# EAGLE design MazeBoard (EAGLE 8.5.0)
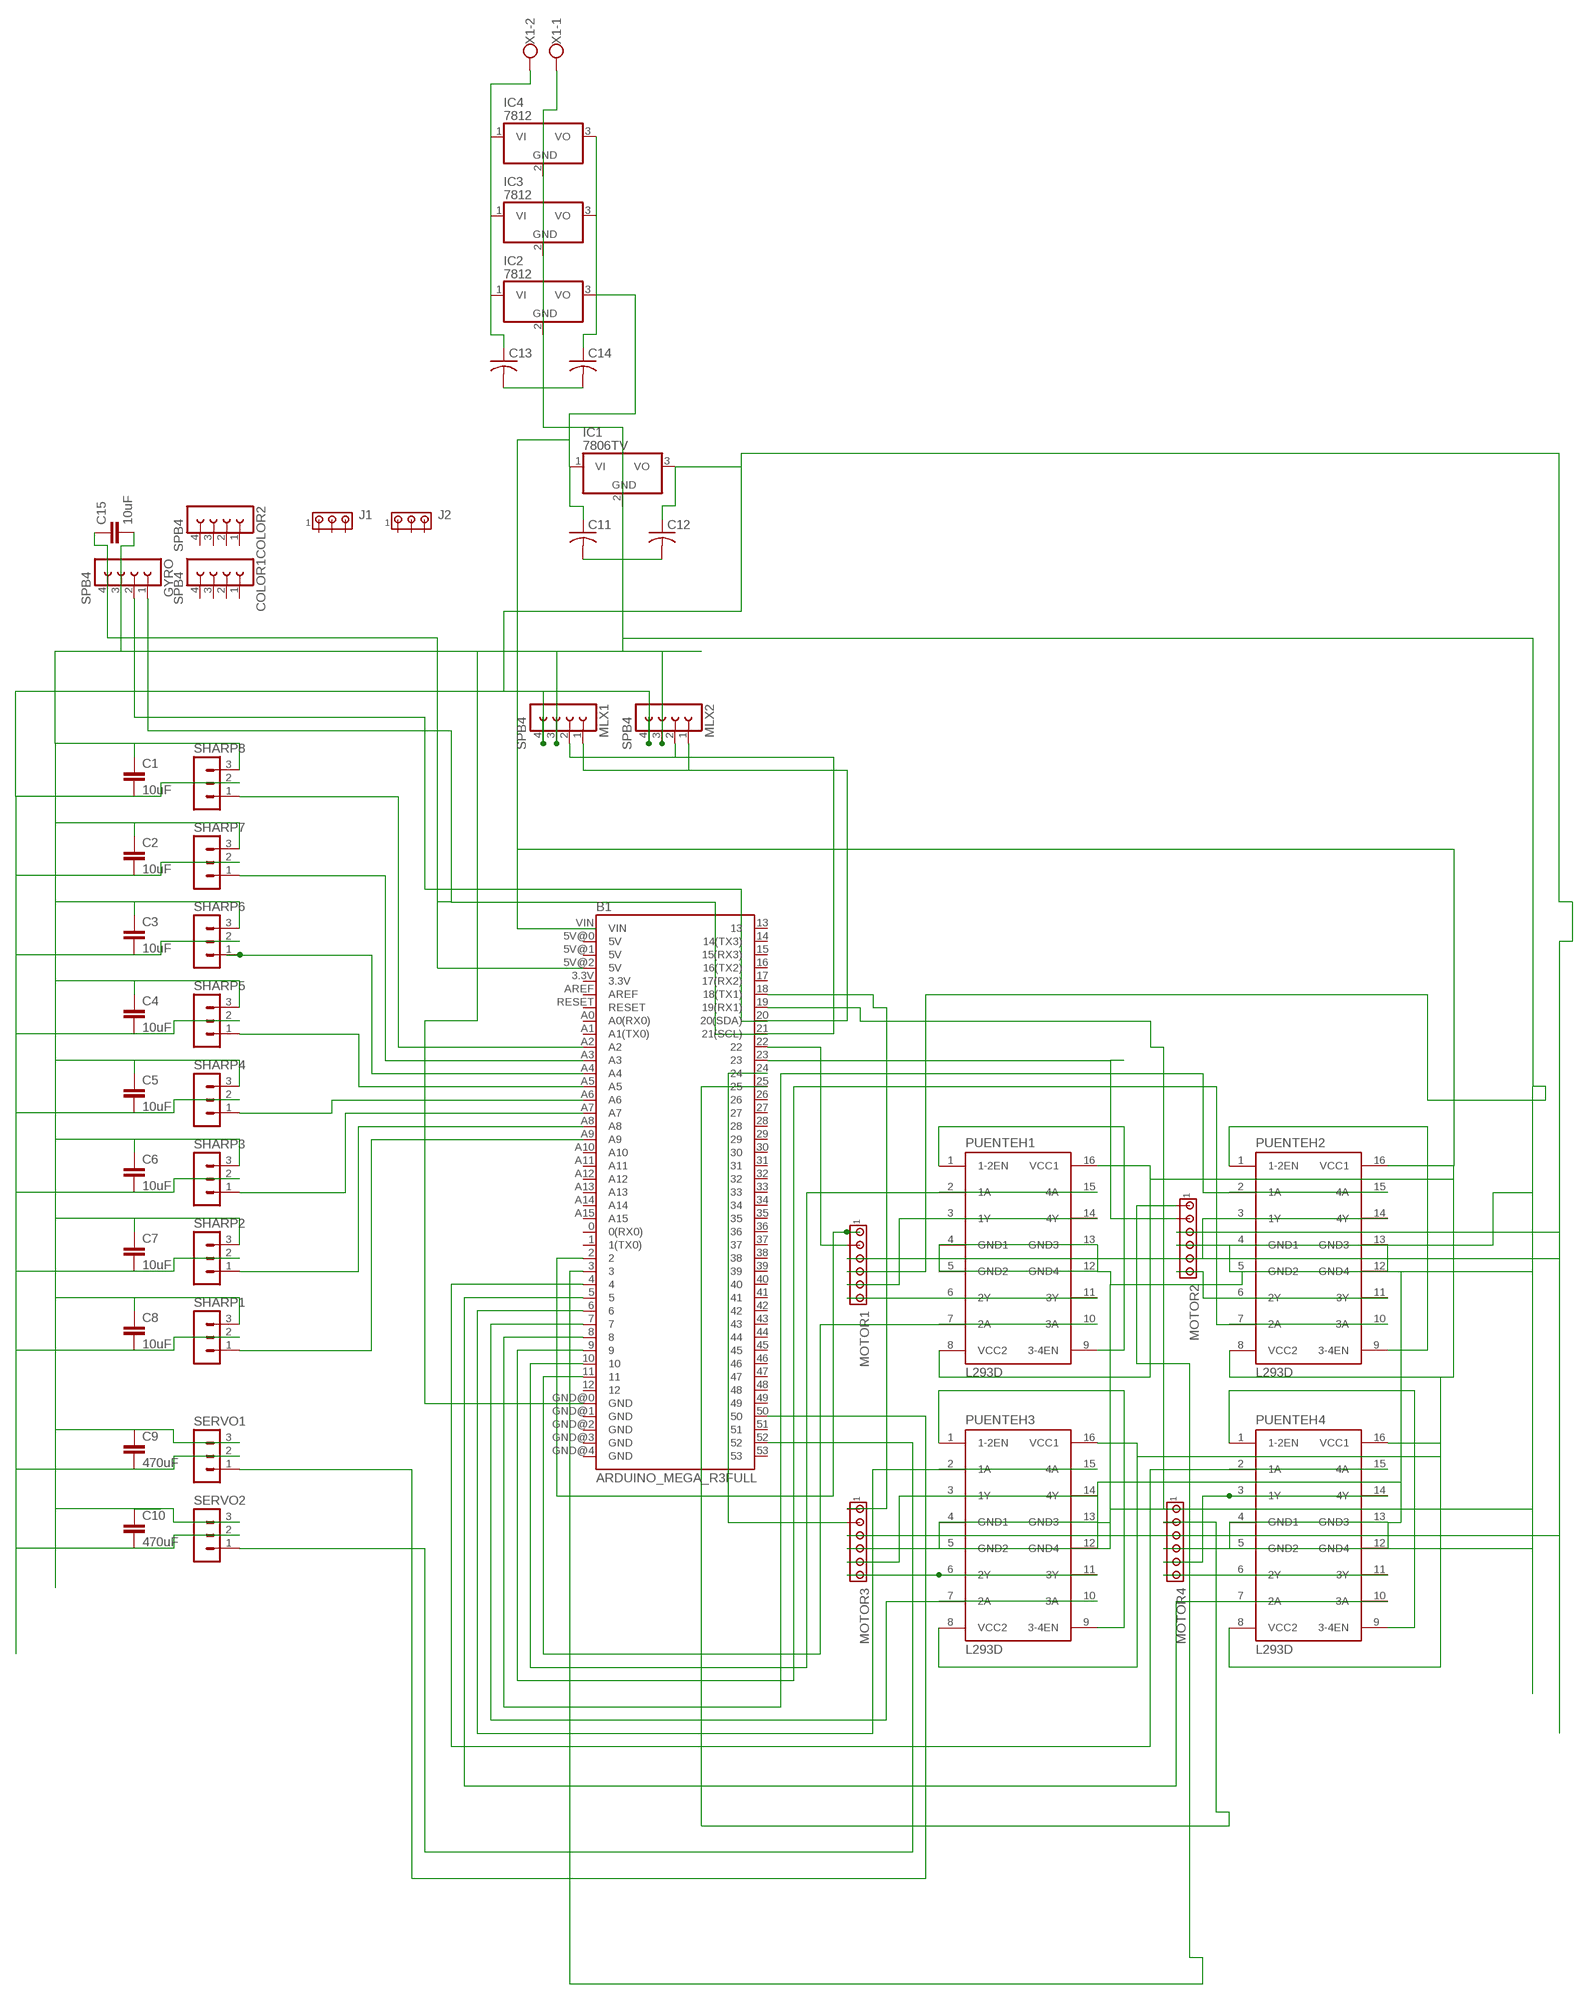
[diagram p0: schematic, sheet 1]

## Parts
B1  ARDUINO_MEGA_R3FULL  [ARDUINO_MEGA]
C1  10uF  C2,5-3  [C2.5-3]
C2  10uF  C2,5-3  [C2.5-3]
C3  10uF  C2,5-3  [C2.5-3]
C4  10uF  C2,5-3  [C2.5-3]
C5  10uF  C2,5-3  [C2.5-3]
C6  10uF  C2,5-3  [C2.5-3]
C7  10uF  C2,5-3  [C2.5-3]
C8  10uF  C2,5-3  [C2.5-3]
C9  470uF  C2,5-3  [C2.5-3]
C10  470uF  C2,5-3  [C2.5-3]
C11  C-US025-024X044  [C025-024X044]
C12  C-US025-024X044  [C025-024X044]
C13  C-US025-024X044  [C025-024X044]
C14  C-US025-024X044  [C025-024X044]
C15  10uF  C2,5-3  [C2.5-3]
COLOR1  SPB4  [SPB4]
COLOR2  SPB4  [SPB4]
GYRO  SPB4  [SPB4]
IC1  7806TV  7805TV  [TO220V]
IC2  7812  7805TV  [TO220V]
IC3  7812  7805TV  [TO220V]
IC4  7812  7805TV  [TO220V]
J1  MTA03-100  [10X03MTA]
J2  MTA03-100  [10X03MTA]
MLX1  SPB4  [SPB4]
MLX2  SPB4  [SPB4]
MOTOR1  MTA06-100  [10X06MTA]
MOTOR2  MTA06-100  [10X06MTA]
MOTOR3  MTA06-100  [10X06MTA]
MOTOR4  MTA06-100  [10X06MTA]
PUENTEH1  L293D  [DIL16]
PUENTEH2  L293D  [DIL16]
PUENTEH3  L293D  [DIL16]
PUENTEH4  L293D  [DIL16]
SERVO1  MA03-1  [MA03-1]
SERVO2  MA03-1  [MA03-1]
SHARP1  MA03-1  [MA03-1]
SHARP2  MA03-1  [MA03-1]
SHARP3  MA03-1  [MA03-1]
SHARP4  MA03-1  [MA03-1]
SHARP5  MA03-1  [MA03-1]
SHARP6  MA03-1  [MA03-1]
SHARP7  MA03-1  [MA03-1]
SHARP8  MA03-1  [MA03-1]
X1  W237-102  [W237-102]

## Nets
6V: C1.2 C2.2 C3.2 C4.2 C5.2 C6.2 C7.2 C8.2 C9.2 C10.2 C12.1 IC1.3(VO) MLX1.4 MLX2.4 MOTOR1.3 MOTOR2.3 MOTOR3.3 MOTOR4.3 SERVO1.2 SERVO2.2 SHARP1.2 SHARP2.2 SHARP3.2 SHARP4.2 SHARP5.2 SHARP6.2 SHARP7.2 SHARP8.2
GND: B1.GND@0(GND) C1.1 C2.1 C3.1 C4.1 C5.1 C6.1 C7.1 C8.1 C9.1 C10.1 C11.2 C12.2 C13.2 C14.2 C15.2 GYRO.3 IC1.2(GND) IC2.2(GND) IC3.2(GND) IC4.2(GND) MLX1.3 MLX2.3 MOTOR1.4 MOTOR2.4 MOTOR3.4 MOTOR4.4 PUENTEH1.4(GND1) PUENTEH1.5(GND2) PUENTEH1.12(GND4) PUENTEH1.13(GND3) PUENTEH2.4(GND1) PUENTEH2.5(GND2) PUENTEH2.12(GND4) PUENTEH2.13(GND3) PUENTEH3.4(GND1) PUENTEH3.5(GND2) PUENTEH3.12(GND4) PUENTEH3.13(GND3) PUENTEH4.4(GND1) PUENTEH4.5(GND2) PUENTEH4.12(GND4) PUENTEH4.13(GND3) SERVO1.3 SERVO2.3 SHARP1.3 SHARP2.3 SHARP3.3 SHARP4.3 SHARP5.3 SHARP6.3 SHARP7.3 SHARP8.3 X1.1
N$1: B1.A4 SHARP6.1
N$2: B1.A5 SHARP5.1
N$3: B1.A6 SHARP4.1
N$4: B1.A7 SHARP3.1
N$5: B1.A2 SHARP8.1
N$6: B1.A3 SHARP7.1
N$7: B1.A8 SHARP2.1
N$8: B1.A9 SHARP1.1
N$9: B1.52 SERVO2.1
N$10: B1.3 MOTOR2.1
N$11: B1.21(21(SCL)) GYRO.1 MLX1.2 MLX2.2
N$12: B1.20(20(SDA)) GYRO.2 MLX1.1 MLX2.1
N$13: B1.5V@2(5V) C15.1 GYRO.4
N$15: PUENTEH1.1(1-2EN) PUENTEH1.9(3-4EN)
N$17: MOTOR3.6 PUENTEH3.6(2Y) PUENTEH3.11(3Y)
N$18: MOTOR3.5 PUENTEH3.3(1Y) PUENTEH3.14(4Y)
N$20: MOTOR4.6 PUENTEH4.6(2Y) PUENTEH4.11(3Y)
N$21: MOTOR4.5 PUENTEH4.3(1Y) PUENTEH4.14(4Y)
N$22: MOTOR1.6 PUENTEH1.6(2Y) PUENTEH1.11(3Y)
N$23: MOTOR1.5 PUENTEH1.3(1Y) PUENTEH1.14(4Y)
N$24: MOTOR2.5 PUENTEH2.3(1Y) PUENTEH2.14(4Y)
N$25: MOTOR2.6 PUENTEH2.6(2Y) PUENTEH2.11(3Y)
N$26: PUENTEH3.1(1-2EN) PUENTEH3.9(3-4EN)
N$27: PUENTEH4.1(1-2EN) PUENTEH4.9(3-4EN)
N$30: B1.7 PUENTEH3.7(2A) PUENTEH3.10(3A)
N$31: B1.6 PUENTEH3.2(1A) PUENTEH3.15(4A)
N$32: B1.4 PUENTEH4.2(1A) PUENTEH4.15(4A)
N$33: B1.5 PUENTEH4.7(2A) PUENTEH4.10(3A)
N$35: B1.11 PUENTEH1.7(2A) PUENTEH1.10(3A)
N$36: B1.10 PUENTEH1.2(1A) PUENTEH1.15(4A)
N$37: B1.2 MOTOR1.1
N$38: B1.9 PUENTEH2.7(2A) PUENTEH2.10(3A)
N$39: PUENTEH2.1(1-2EN) PUENTEH2.9(3-4EN)
N$41: B1.18(18(TX1)) MOTOR3.1
N$42: B1.19(19(RX1)) MOTOR4.1
N$43: B1.50 SERVO1.1
N$44: B1.22 MOTOR1.2
N$45: B1.8 PUENTEH2.2(1A) PUENTEH2.15(4A)
N$46: B1.24 MOTOR3.2
N$47: B1.25 MOTOR4.2
N$48: B1.23 MOTOR2.2
N$52: C11.1 C14.1 IC1.1(VI) IC2.3(VO) IC3.3(VO) IC4.3(VO) PUENTEH1.8(VCC2) PUENTEH1.16(VCC1) PUENTEH2.8(VCC2) PUENTEH2.16(VCC1) PUENTEH3.8(VCC2) PUENTEH3.16(VCC1) PUENTEH4.8(VCC2) PUENTEH4.16(VCC1)
N$54: C13.1 IC2.1(VI) IC3.1(VI) IC4.1(VI) X1.2
Unconnected: B1.0(0(RX0)) B1.1(1(TX0)) B1.3.3V B1.5V@0(5V) B1.5V@1(5V) B1.12 B1.13 B1.14(14(TX3)) B1.15(15(RX3)) B1.16(16(TX2)) B1.17(17(RX2)) B1.26 B1.27 B1.28 B1.29 B1.30 B1.31 B1.32 B1.33 B1.34 B1.35 B1.36 B1.37 B1.38 B1.39 B1.40 B1.41 B1.42 B1.43 B1.44 B1.45 B1.46 B1.47 B1.48 B1.49 B1.51 B1.53 B1.A0(A0(RX0)) B1.A1(A1(TX0)) B1.A10 B1.A11 B1.A12 B1.A13 B1.A14 B1.A15 B1.AREF B1.GND@1(GND) B1.GND@2(GND) B1.GND@3(GND) B1.GND@4(GND) B1.RESET B1.VIN COLOR1.1 COLOR1.2 COLOR1.3 COLOR1.4 COLOR2.1 COLOR2.2 COLOR2.3 COLOR2.4 J1.1 J1.2 J1.3 J2.1 J2.2 J2.3

## Library data of the parts
B1 = SparkFun-Boards:ARDUINO_MEGA_R3: Arduino Mega R3 ATmega2560 R3 compatible footprint. SparkFun Products: Arduino Mega 2560 R3 <https://www.sparkfun.com/products/11061>
C1-C10 C15 = capacitor-wima:C: CAPACITOR naming: grid - package width
C11-C14 = rcl:C-US: CAPACITOR, American symbol
COLOR1 COLOR2 GYRO MLX1 MLX2 = con-hirschmann:SPB4: CONNECTOR 4 pins; OC_FARNELL: unknown; OC_NEWARK: unknown
IC1-IC4 = linear:78*: Positive VOLTAGE REGULATOR Source: http://cache.national.com/ds/LM/LM78L05.pdf http://www.fairchildsemi.com/ds/LM/LM7805.pdf
J1 J2 = con-amp:MTA03-100: AMP connector
MOTOR1-MOTOR4 = con-amp:MTA06-100: AMP connector Connection corrected 2014-09-19
PUENTEH1-PUENTEH4 = st-microelectronics:L293D: PUSH-PULL 4 CHANNEL DRIVER; MPN: L293D; OC_FARNELL: 9589619; OC_NEWARK: 56P8249
SERVO1 SERVO2 SHARP1-SHARP8 = con-lstb:MA03-1: PIN HEADER; OC_FARNELL: unknown; OC_NEWARK: unknown
X1 = con-wago-500:W237-102: WAGO SCREW CLAMP; MPN: 237-102; OC_FARNELL: unknown; OC_NEWARK: 70K9898

## Board
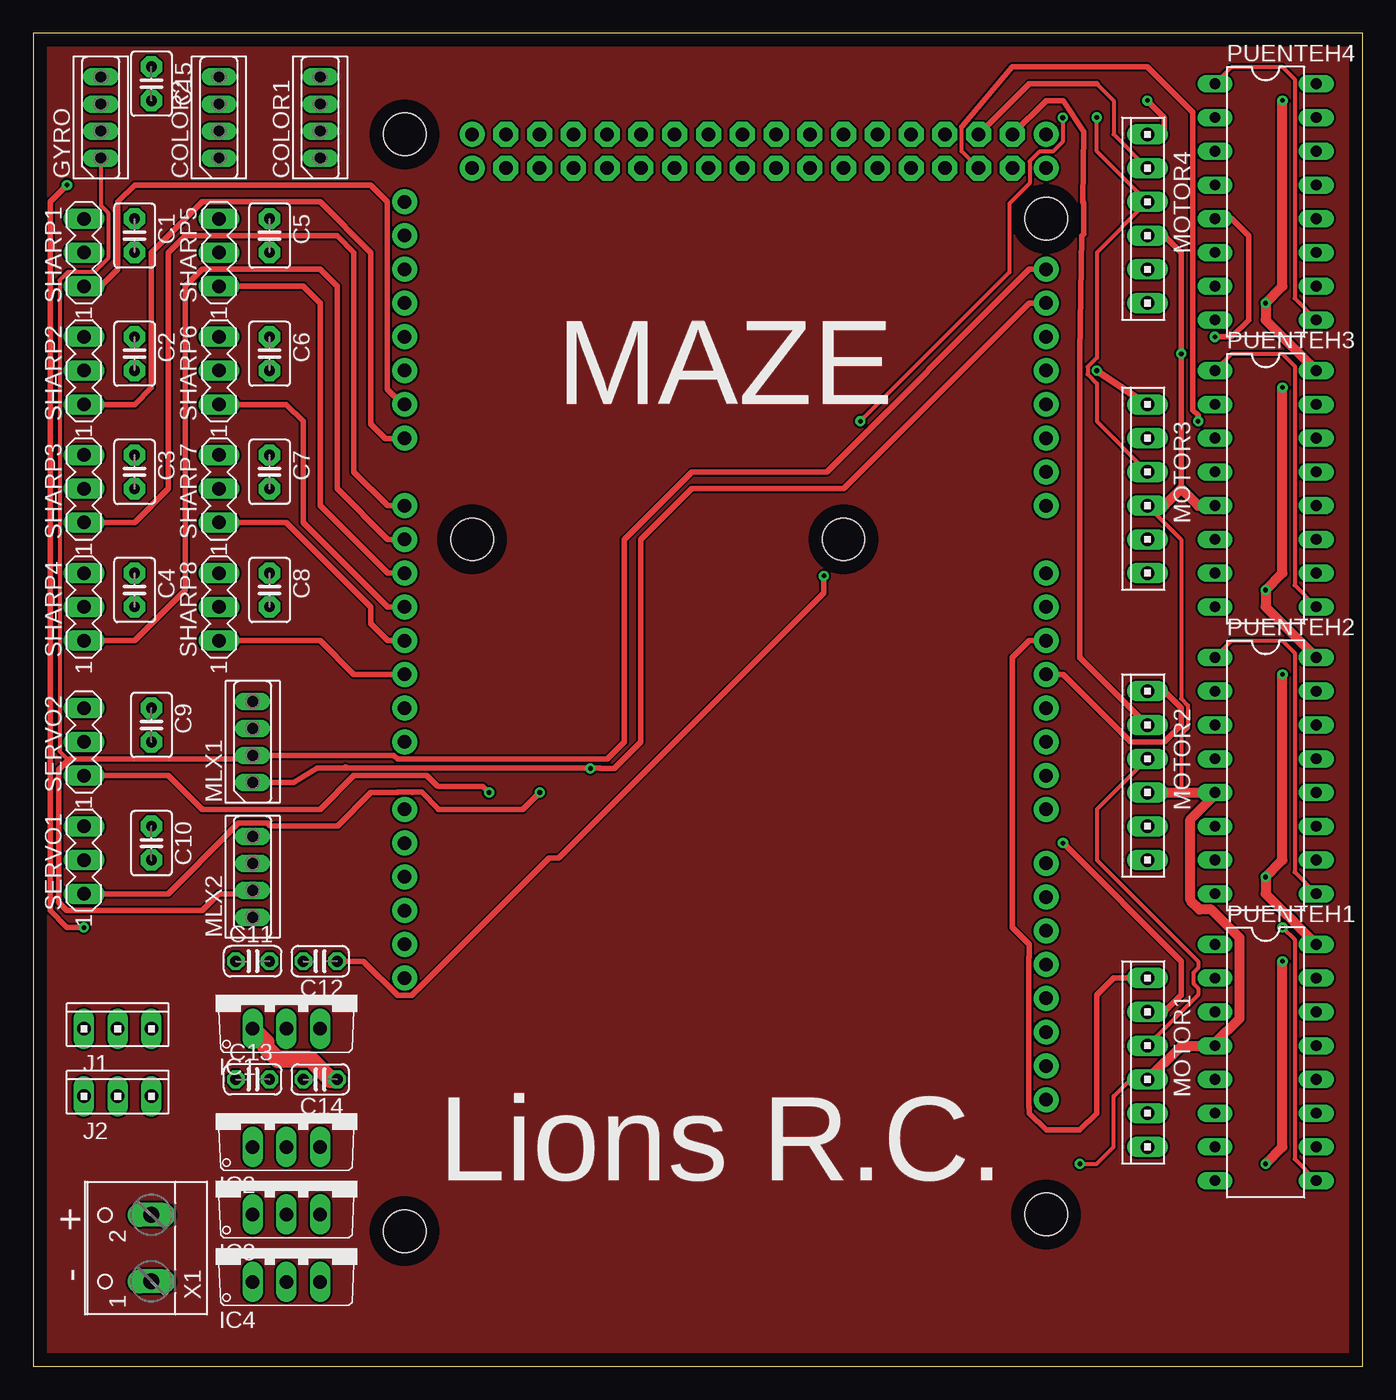
[diagram p1: board, top side]
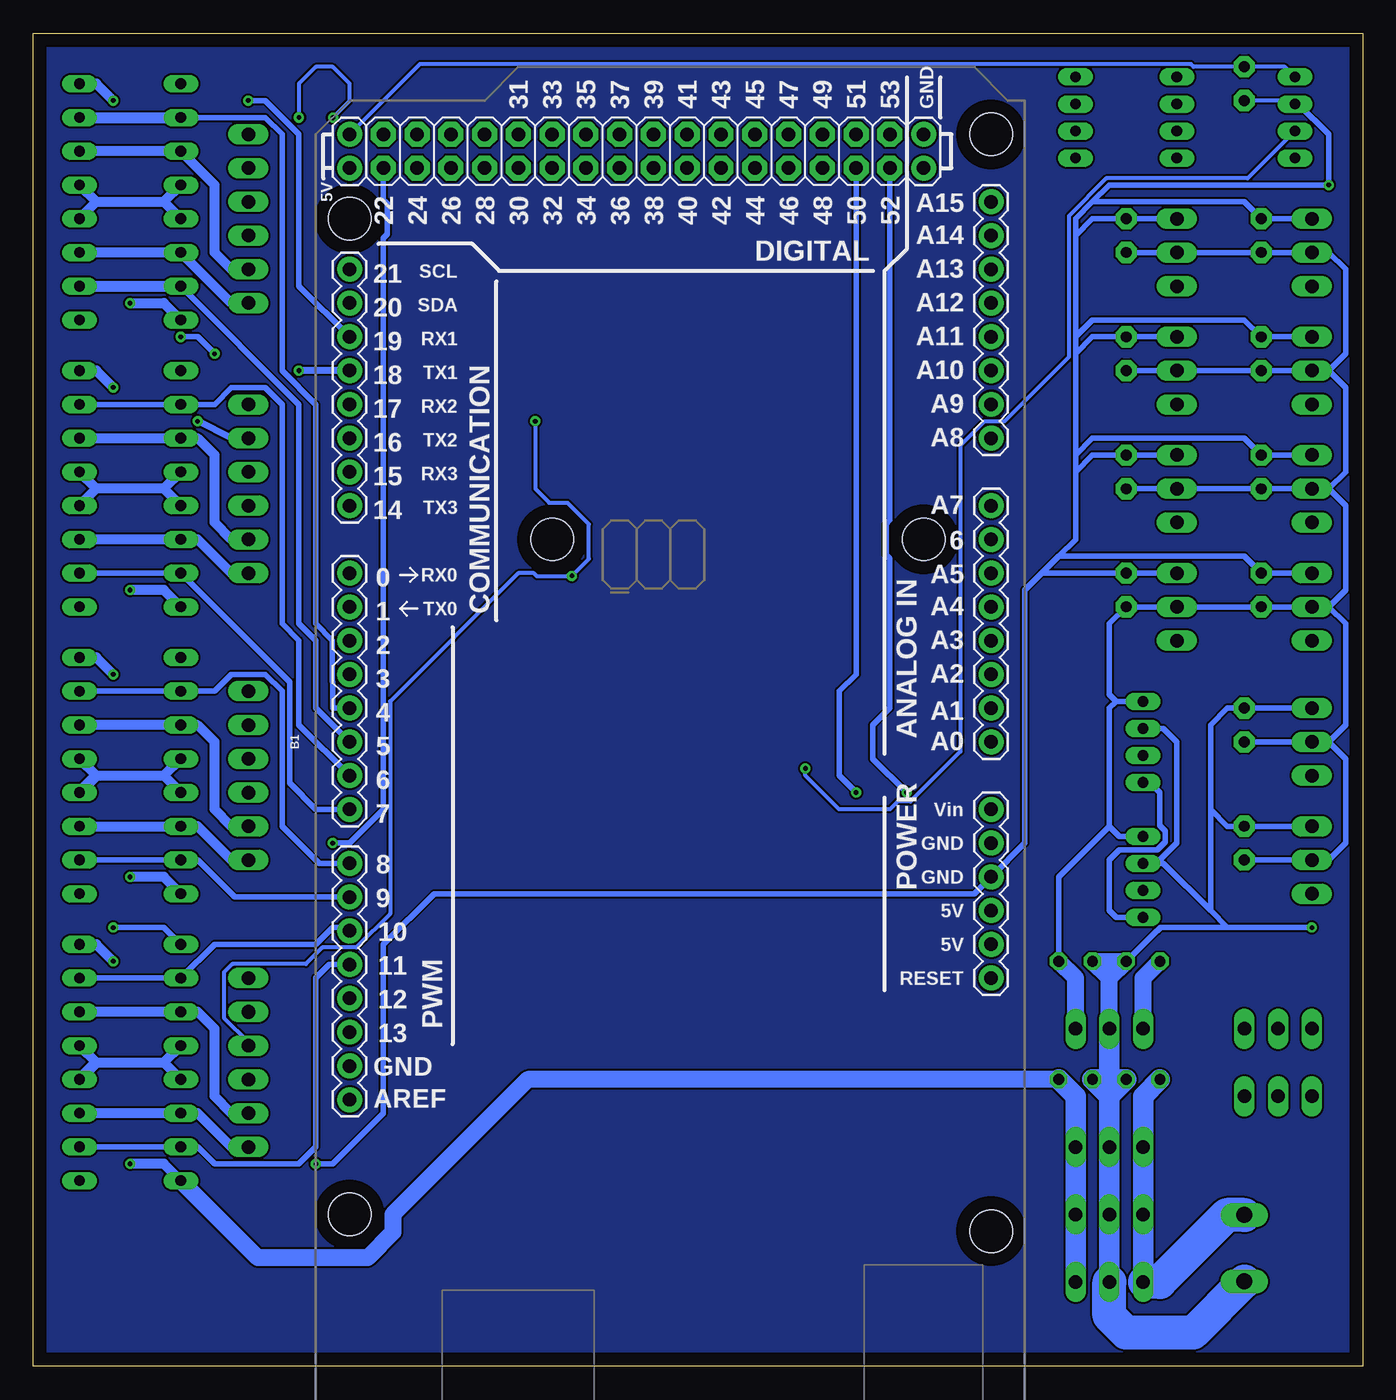
[diagram p2: board, bottom side, seen from below]

Size 100 x 100.32 mm. Coordinates in mm from the lower left corner, seen from the top.
Outline: 0,0 100,0 100,100.32 0,100.32 0,0
Copper layers (1*16): Top 0.035mm / dielectric 1.5mm / Bottom 0.035mm
Design rules "default": minimum track width 6mil, minimum drill 0.35mm, track to track 6mil, track to pad 6mil, pad to pad 6mil, via to via 6mil, smd to smd 6mil, copper to edge 40mil, drill to drill 6mil, minimum pad ring 10mil, minimum via ring 8mil, stop-mask expansion 4mil, vias tented up to drill 0mil, thermal gap 10mil

### Footprints (pad centres in the part's own frame; a part is rotated, then mirrored left to right if it is on the bottom)
ARDUINO_MEGA = drill 1.016 pad 1.88: 0 13.97,24.13; 1 11.43,24.13; 2 8.89,24.13; 3 6.35,24.13; 3.3V -13.97,-24.13; 4 3.81,24.13; 5 1.27,24.13; 5V@0 -11.43,-24.13; 5V@1 44.45,24.13; 5V@2 46.99,24.13; 6 -1.27,24.13; 7 -3.81,24.13; 8 -7.874,24.13; 9 -10.414,24.13; 10 -12.954,24.13; 11 -15.494,24.13; 12 -18.034,24.13; 13 -20.574,24.13; 14 19.05,24.13; 15 21.59,24.13; 16 24.13,24.13; 17 26.67,24.13; 18 29.21,24.13; 19 31.75,24.13; 20 34.29,24.13; 21 36.83,24.13; A0 1.27,-24.13; A1 3.81,-24.13; A2 6.35,-24.13; A3 8.89,-24.13; A4 11.43,-24.13; A5 13.97,-24.13; A6 16.51,-24.13; A7 19.05,-24.13; A8 24.13,-24.13; A9 26.67,-24.13; A10 29.21,-24.13; A11 31.75,-24.13; A12 34.29,-24.13; A13 36.83,-24.13; A14 39.37,-24.13; A15 41.91,-24.13; AREF -25.654,24.13; GND@0 -8.89,-24.13; GND@1 -6.35,-24.13; GND@2 44.45,-19.05; GND@3 46.99,-19.05; GND@4 -23.114,24.13; RESET -16.51,-24.13; VIN -3.81,-24.13 | drill 1.016 pad 1.88 octagon: 22 44.45,21.59; 23 46.99,21.59; 24 44.45,19.05; 25 46.99,19.05; 26 44.45,16.51; 27 46.99,16.51; 28 44.45,13.97; 29 46.99,13.97; 30 44.45,11.43; 31 46.99,11.43; 32 44.45,8.89; 33 46.99,8.89; 34 44.45,6.35; 35 46.99,6.35; 36 44.45,3.81; 37 46.99,3.81; 38 44.45,1.27; 39 46.99,1.27; 40 44.45,-1.27; 41 46.99,-1.27; 42 44.45,-3.81; 43 46.99,-3.81; 44 44.45,-6.35; 45 46.99,-6.35; 46 44.45,-8.89; 47 46.99,-8.89; 48 44.45,-11.43; 49 46.99,-11.43; 50 44.45,-13.97; 51 46.99,-13.97; 52 44.45,-16.51; 53 46.99,-16.51 | hole 3.2: -34.29,24.13; -35.56,-24.13; 16.51,8.89; 16.51,-19.05; 40.64,24.13; 46.99,-24.13
C2.5-3 = drill 0.813 pad 1.6 octagon: 1 -1.27,0; 2 1.27,0
C025-024X044 = drill 0.813 octagon: 1 -1.27,0; 2 1.27,0
SPB4 = drill 0.813 long: 1 -3.048,0; 2 -1.016,0; 3 1.016,0; 4 3.048,0
TO220V = drill 1.016 long: 1 -2.54,-2.54; 2 0,-2.54; 3 2.54,-2.54
10X03MTA = drill 1.016 long: 1 2.54,0; 2 0,0; 3 -2.54,0
10X06MTA = drill 1.016 long: 1 6.35,0; 2 3.81,0; 3 1.27,0; 4 -1.27,0; 5 -3.81,0; 6 -6.35,0
DIL16 = drill 0.813 long: 1 -8.89,-3.81; 2 -6.35,-3.81; 3 -3.81,-3.81; 4 -1.27,-3.81; 5 1.27,-3.81; 6 3.81,-3.81; 7 6.35,-3.81; 8 8.89,-3.81; 9 8.89,3.81; 10 6.35,3.81; 11 3.81,3.81; 12 1.27,3.81; 13 -1.27,3.81; 14 -3.81,3.81; 15 -6.35,3.81; 16 -8.89,3.81
MA03-1 = drill 1.016 long: 1 -2.54,0; 2 0,0; 3 2.54,0
W237-102 = drill 1.194 long: 1 -2.5,-1.27; 2 2.5,-1.27

### Placement (x,y rotation side)
B1  52.07,45.72 90 bottom
C1  7.62,85.09 270 top
C2  7.62,76.2 270 top
C3  7.62,67.31 270 top
C4  7.62,58.42 270 top
C5  17.78,85.09 270 top
C6  17.78,76.2 270 top
C7  17.78,67.31 270 top
C8  17.78,58.42 270 top
C9  8.89,48.26 270 top
C10  8.89,39.37 270 top
C11  16.51,30.48 0 top
C12  21.59,30.48 180 top
C13  16.51,21.59 0 top
C14  21.59,21.59 180 top
C15  8.89,96.52 270 top
COLOR1  21.59,93.98 90 top
COLOR2  13.97,93.98 90 top
GYRO  5.08,93.98 90 top
IC1  19.05,27.94 0 top
IC2  19.05,19.05 0 top
IC3  19.05,13.97 0 top
IC4  19.05,8.89 0 top
J1  6.35,25.4 0 top
J2  6.35,20.32 0 top
MLX1  16.51,46.99 90 top
MLX2  16.51,36.83 90 top
MOTOR1  83.82,22.86 90 top
MOTOR2  83.82,44.45 90 top
MOTOR3  83.82,66.04 90 top
MOTOR4  83.82,86.36 90 top
PUENTEH1  92.71,22.86 270 top
PUENTEH2  92.71,44.45 270 top
PUENTEH3  92.71,66.04 270 top
PUENTEH4  92.71,87.63 270 top
SERVO1  3.81,38.1 90 top
SERVO2  3.81,46.99 90 top
SHARP1  3.81,83.82 90 top
SHARP2  3.81,74.93 90 top
SHARP3  3.81,66.04 90 top
SHARP4  3.81,57.15 90 top
SHARP5  13.97,83.82 90 top
SHARP6  13.97,74.93 90 top
SHARP7  13.97,66.04 90 top
SHARP8  13.97,57.15 90 top
X1  7.62,8.89 90 top

### Tracks (layer width: path | path; a pad name or v marks a point on that pad's centre or on a via)
6V  (via drill 0.35)
  Top 0.305: MOTOR3.3 80.01,71.12 80.01,73.96 79.33,74.65 79.33,75.21 80.01,75.9 80.01,83.82 MOTOR4.3 80.01,91.44 v80.01,93.98 | MOTOR2.3 80.01,41.91 80.01,38.1 87.63,30.48 87.63,29.96 87.27,29.61 87.27,28.81 87.63,28.45 87.63,27.94 MOTOR1.3 | v62.23,71.12 73.43,82.32 73.43,87.51 74.95,89.03 74.95,90.69 75.68,91.41 76.72,91.41 77.45,92.14 v77.45,93.96
  Top 0.406: C12.1 24.84,30.48 27.4,27.91 28.48,27.91 38.83,38.27 39.54,38.27 59.48,58.21 v59.48,59.48 59.6,59.6
  Bottom 0.305: v62.23,71.12 62.23,66.04 61.19,65 59.81,65 58.19,63.38 58.19,60.76 v59.48,59.48 | 59.8,59.48 59.64,59.64 v59.48,59.48 | MOTOR1.3 83.82,24.4 85.65,26.23 85.65,29.65 85.02,30.28 79.5,30.28 78.25,31.52 75.68,31.52 73.15,34.05 73.15,50.04 63.5,59.69 62.34,59.69 62.11,59.46 59.81,59.46 59.8,59.48 | v77.45,93.96 77.45,94 76.2,95.25 76.2,96.52 77.47,97.79 78.74,97.79 80.01,96.52 v80.01,93.98 | 59.8,59.48 v59.48,59.48
  Bottom 0.406: C10.2 SERVO1.2 2.54,38.1 1.27,39.37 1.27,45.72 2.54,46.99 | C9.2 SERVO2.2 2.54,46.99 | C5.2 SHARP5.2 C1.2 SHARP1.2 2.54,83.82 1.27,82.55 1.27,76.2 2.54,74.93 | C6.2 SHARP6.2 C2.2 SHARP2.2 2.54,74.93 | C7.2 SHARP7.2 C3.2 SHARP3.2 2.54,66.04 | 2.54,66.04 1.27,64.77 1.27,58.42 2.54,57.15 | 2.54,74.93 1.27,73.66 1.27,67.31 2.54,66.04 | 2.54,57.15 SHARP4.2 C4.2 SHARP8.2 C8.2 19.05,55.88 19.05,50.55 18.54,50.04 | 2.54,57.15 1.27,55.88 1.27,48.26 2.54,46.99 | MLX2.4 18.29,39.88 19.05,40.64 | 18.54,50.04 MLX1.4 | 18.54,50.04 19.05,49.53 19.05,40.64 | 19.05,40.64 22.86,36.83 C12.1 | 59.6,59.6 v59.48,59.48
  Bottom 1.27: IC1.3 21.59,29.21 C12.1
GND  (via drill 0.35)
  Top 0.305: MOTOR3.4 86.36,62.23 86.36,50.25 86.87,49.74 86.87,48.05 86.36,47.54 86.36,43.18 | v78.74,15.24 80.01,15.24 81.28,16.51 81.28,20.32 82.55,21.59
  Top 0.406: 82.55,21.59 MOTOR1.4 84.84,22.1 | 86.36,43.18 MOTOR2.4 | MOTOR4.4 85.09,85.09 86.36,83.82 v86.36,76.2 86.36,66.04 | v2.54,88.9 1.27,87.63 1.27,34.29 2.54,33.02 v3.81,33.02 | PUENTEH4.5 90.17,86.36 91.44,85.09 91.44,78.74 90.17,77.47 v88.9,77.47
  Top 0.762: PUENTEH3.5 87.63,64.77 86.36,66.04 85.09,64.77 MOTOR3.4 | 86.36,43.18 PUENTEH2.5 | PUENTEH2.5 88.9,42.99 87.05,41.13 87.05,35.07 87.75,34.37 88.63,34.37 90.75,32.24 90.75,26.18 88.9,24.32 PUENTEH1.4 86.41,24.13 85.12,22.84 85.06,22.84 MOTOR1.4 | MOTOR2.4 PUENTEH2.5
  Bottom 0.305: GYRO.3 5.33,95.25 C15.2
  Bottom 0.406: SERVO1.3 C10.1 10.16,40.64 11.43,41.91 | SERVO2.3 C9.1 10.16,49.53 11.43,48.26 11.43,41.91 | SHARP4.3 C4.1 8.89,60.96 22.86,60.96 | SHARP3.3 C3.1 8.89,69.85 20.32,69.85 21.59,68.58 | SHARP1.3 C1.1 8.89,87.63 20.32,87.63 | SHARP2.3 C2.1 8.89,78.74 20.32,78.74 21.59,77.47 | SHARP5.3 C5.1 20.32,86.36 21.59,85.09 | SHARP6.3 C6.1 20.32,77.47 21.59,76.2 | SHARP7.3 C7.1 20.32,68.58 21.59,67.31 | SHARP8.3 C8.1 24.13,59.69 | 21.59,67.31 21.59,62.23 22.86,60.96 | 22.86,60.96 24.13,59.69 | 21.59,68.58 21.59,76.2 | 21.59,68.58 21.59,67.31 | 21.59,77.47 21.59,85.09 | 21.59,77.47 21.59,76.2 | 20.32,87.63 21.59,86.36 21.59,85.09 | 11.43,34.29 11.43,41.91 | 11.43,34.29 10.16,33.02 | 10.16,33.02 v3.81,33.02 | 20.32,87.63 19.05,88.9 v2.54,88.9 2.54,92.71 4.83,95 GYRO.3 | 24.13,59.69 25.4,58.42 25.4,39.37 B1.GND@0 29.21,35.56 69.85,35.56 73.66,31.75 73.66,19.05 77.47,15.24 v78.74,15.24 | MLX1.3 14.99,48.01 13.97,46.99 13.97,39.37 15.24,38.1 16.26,38.1 MLX2.3 14.99,37.85 11.43,34.29 | 10.16,33.02 15.18,33.02 15.43,32.77 15.49,32.77 C11.2 | v88.9,77.47 87.63,77.47 v86.36,76.2
  Bottom 0.762: 90.17,44.45 PUENTEH2.5 | 90.17,44.45 95.25,44.45 PUENTEH2.13 | PUENTEH2.4 90.17,44.45 | 90.17,87.63 PUENTEH4.5 | 95.25,87.63 90.17,87.63 | 95.25,87.63 PUENTEH4.12 | PUENTEH4.13 95.25,87.63 | PUENTEH4.4 90.17,87.63 | PUENTEH3.5 90.17,66.04 | 90.17,66.04 95.25,66.04 | PUENTEH3.12 95.25,66.04 | 95.25,66.04 PUENTEH3.13 | PUENTEH3.4 90.17,66.04 | 90.17,22.86 PUENTEH1.5 | 90.17,22.86 95.25,22.86 PUENTEH1.13 | PUENTEH1.4 90.17,22.86
  Bottom 0.813: PUENTEH2.12 95.25,44.45 | PUENTEH1.12 95.25,22.86
  Bottom 1.27: IC3.2 IC2.2 | IC1.2 19.05,29.21 | 19.05,29.21 C11.2 C12.2 19.05,29.21
  Bottom 1.524: IC4.2 IC2.2 19.05,20.32 | 19.05,20.32 C14.2 | 19.05,20.32 C13.2 C14.2 | IC1.2 19.05,21.59 C14.2
  Bottom 2.54: X1.1 12.74,2.54 17.78,2.54 19.05,3.81 IC4.2
N$1
  Top 0.406: SHARP6.1 19.05,72.39 20.32,71.12 20.32,63.5 26.67,57.15 B1.A4
N$2
  Top 0.406: SHARP5.1 20.32,81.28 21.59,80.01 21.59,64.77 26.67,59.69 B1.A5
N$3
  Top 0.406: SHARP4.1 7.62,54.61 11.43,58.42 11.43,81.28 12.7,82.55 21.59,82.55 22.86,81.28 22.86,66.04 26.67,62.23 B1.A6
N$4
  Top 0.406: SHARP3.1 7.62,63.5 10.16,66.04 10.16,83.82 11.43,85.09 22.86,85.09 24.13,83.82 24.13,67.31 26.67,64.77 B1.A7
N$5
  Top 0.406: SHARP8.1 21.59,54.61 24.13,52.07 B1.A2
N$6
  Top 0.406: B1.A3 26.67,54.61 25.4,55.88 25.4,57.15 19.05,63.5 SHARP7.1
N$7
  Top 0.406: SHARP2.1 7.62,72.39 8.89,73.66 8.89,83.82 12.7,87.63 21.59,87.63 25.4,83.82 25.4,70.9 26.48,69.82 27.91,69.82 B1.A8
N$8
  Top 0.406: SHARP1.1 5.08,81.28 6.35,82.55 6.35,87.63 7.62,88.9 25.4,88.9 26.64,87.66 26.64,73.54 27.17,73.01 B1.A9
N$9  (via drill 0.35)
  Top 0.406: SERVO2.1 10.16,44.45 12.7,41.91 21.59,41.91 24.13,44.45 29.6,44.45 30.38,43.67 30.54,43.65 33.82,43.65 v34.29,43.18
  Bottom 0.406: B1.52 35.56,63.68 35.84,63.4 35.84,61.06 35.56,60.78 35.56,49.53 36.83,48.26 36.83,45.72 v34.29,43.18
N$10
  Top 0.406: B1.3 77.47,52.07 82.55,46.99 85.09,46.99 86.36,48.26 86.36,49.53 85.09,50.8 MOTOR2.1
N$11
  Top 0.305: GYRO.1 5.08,87.36 5.64,86.8 5.64,83.38 4.61,82.35 2.61,82.35 1.98,81.72 1.98,46.28 2.64,45.62
  Top 0.406: MLX2.2 16.26,35.56 13.97,35.56 12.7,34.29 2.54,34.29 1.93,34.9 1.93,44.91 2.64,45.62 2.74,45.72 15.24,45.72 15.49,45.97 MLX1.2 27.12,45.97 27.4,45.7 28.48,45.7 28.5,45.72 43.18,45.72 44.45,46.99 44.45,62.23 49.53,67.31 59.69,67.31 74.93,82.55 B1.21
N$12  (via drill 0.35)
  Top 0.305: v41.91,44.99 41.89,45.01 40.64,45.01
  Top 0.406: MLX1.1 19.58,43.94 21.36,45.01 23.42,45.01 23.49,45.09 23.57,45.01 40.64,45.01 42.62,45.01 42.65,44.98 43.71,44.98 45.72,46.99 45.72,62.23 49.53,66.04 60.96,66.04 74.93,80.01 B1.20
  Bottom 0.305: GYRO.2 8.64,89.41 19.26,89.41 22.1,86.57 22.1,75.95 26.95,71.09 28.46,71.09 30.25,69.3 30.25,46.25 34.01,42.5 34.97,42.5 35.56,41.91 39.37,41.91 41.91,44.45 v41.91,44.99
  Bottom 0.406: MLX1.1 16,43.94 15.24,43.18 15.24,40.7 14.83,40.3 14.83,39.46 15.43,38.86 18.29,38.86 19.05,38.1 19.05,34.29 18.54,33.78 MLX2.1
N$13
  Bottom 0.305: GYRO.4 5.84,97.79 C15.1 12.71,97.79 12.91,97.99 70.92,97.99 B1.5V@2
N$14
  pour Top: 0,100.33 100.33,100.33 100.33,0 0,0
N$15  (via drill 0.35)
  Top 0.305: v93.98,33.02 94.89,32.11 94.89,15.6 PUENTEH1.9
  Bottom 0.406: PUENTEH1.1 90.17,33.02 v93.98,33.02
N$16
  pour Bottom: 0,100.33 100.33,100.33 100.33,0 0,0
N$17
  Bottom 0.762: MOTOR3.6 85.09,59.69 87.63,62.23 PUENTEH3.6 PUENTEH3.11
N$18
  Bottom 0.762: PUENTEH3.14 PUENTEH3.3 87.63,69.85 86.36,68.58 86.36,63.5 85.09,62.23 MOTOR3.5
N$20
  Bottom 0.762: MOTOR4.6 85.09,80.01 PUENTEH4.6 PUENTEH4.11
N$21
  Bottom 0.762: PUENTEH4.14 PUENTEH4.3 86.36,88.9 86.36,83.82 85.09,82.55 MOTOR4.5
N$22
  Bottom 0.762: MOTOR1.6 85.09,16.51 87.63,19.05 PUENTEH1.6 PUENTEH1.11
N$23
  Bottom 0.762: MOTOR1.5 85.09,19.05 86.36,20.32 86.36,25.4 87.63,26.67 PUENTEH1.3 PUENTEH1.14
N$24
  Bottom 0.762: MOTOR2.5 85.09,40.64 86.36,41.91 86.36,46.99 87.63,48.26 PUENTEH2.3 PUENTEH2.14
N$25
  Bottom 0.762: PUENTEH2.11 PUENTEH2.6 87.63,40.64 85.09,38.1 MOTOR2.6
N$26
  Top 0.305: PUENTEH3.1 90.17,76.2 93.98,76.2 94.89,75.29 94.89,58.78 PUENTEH3.9
N$27
  Top 0.305: PUENTEH4.1 90.17,97.79 93.98,97.79 94.89,96.88 94.89,80.37 PUENTEH4.9
N$30
  Bottom 0.406: B1.7 78.74,41.91 80.72,43.89 80.72,51.51 PUENTEH3.7 PUENTEH3.10
N$31
  Bottom 0.406: B1.6 80.01,48.26 80.01,54.61 81.28,55.88 81.28,72.39 82.55,73.66 85.09,73.66 86.36,72.39 PUENTEH3.2 PUENTEH3.15
N$32
  Bottom 0.406: B1.4 77.47,49.53 77.47,51.51 77.5,51.53 77.5,54.63 78.74,55.88 78.74,72.39 81.28,74.93 81.28,92.71 82.55,93.98 PUENTEH4.2
  Bottom 0.813: PUENTEH4.15 PUENTEH4.2
N$33
  Bottom 0.406: B1.5 78.74,49.53 78.74,54.61 80.01,55.88 80.01,72.39 PUENTEH4.7
  Bottom 0.813: PUENTEH4.10 PUENTEH4.7
N$35
  Bottom 0.406: PUENTEH1.10 PUENTEH1.7 87.63,16.51 86.36,15.24 80.01,15.24 78.74,16.51 78.74,29.21 77.72,30.23 B1.11
N$36
  Bottom 0.406: PUENTEH1.15 PUENTEH1.2 86.36,31.75 78.74,31.75 77.47,33.02 76.45,33.02 B1.10
N$37
  Top 0.406: B1.2 74.93,54.61 73.66,53.34 73.66,33.02 74.93,31.75 74.93,30.79 74.91,30.76 74.91,19.53 74.93,19.5 74.93,19.05 76.2,17.78 78.74,17.78 80.01,19.05 80.01,27.94 81.28,29.21 MOTOR1.1
N$38
  Bottom 0.406: B1.9 84.84,35.31 87.63,38.1 PUENTEH2.7 PUENTEH2.10
N$39
  Top 0.305: PUENTEH2.1 90.17,54.61 93.98,54.61 94.89,53.7 94.89,37.19 PUENTEH2.9
N$41  (via drill 0.35)
  Top 0.508: v80.01,74.93 MOTOR3.1
  Bottom 0.508: B1.18 v80.01,74.93
N$42  (via drill 0.35)
  Top 0.406: v83.82,95.25 85.09,93.98 85.09,92.71 MOTOR4.1
  Bottom 0.406: v83.82,95.25 82.55,95.25 80.01,92.71 80.01,81.28 B1.19
N$43  (via drill 0.35)
  Top 0.406: SERVO1.1 10.16,35.56 14.83,40.23 14.83,40.3 15.43,40.89 17.59,40.89 17.81,40.67 22.89,40.67 25.4,43.18 27.38,43.18 27.4,43.2 27.94,43.2 | 27.94,43.2 28.48,43.2 28.5,43.18 | 27.94,43.2 29.21,43.2 30.48,41.93 30.48,41.91 36.83,41.91 v38.1,43.18
  Bottom 0.406: v38.1,43.18 39.37,44.45 39.37,50.8 38.1,52.07 B1.50
N$44  (via drill 0.35)
  Top 0.406: MOTOR1.2 85.09,26.67 86.36,27.94 86.36,30.48 v77.47,39.37
  Bottom 0.406: B1.22 73.66,87.81 73.38,87.53 73.38,85.19 73.66,84.91 73.66,41.91 76.2,39.37 v77.47,39.37
N$45
  Bottom 0.406: PUENTEH2.15 PUENTEH2.2 86.36,50.8 85.09,52.07 82.55,52.07 81.28,50.8 81.28,40.64 78.74,38.1 78.49,37.85 B1.8
N$46  (via drill 0.35)
  Top 0.305: 69.85,93.27 69.85,91.44 B1.24
  Top 0.406: 69.85,93.27 73.66,97.79 83.82,97.79 87.22,94.39 87.22,71.97 87.63,71.56 v87.63,71.12
  Bottom 0.508: v87.63,71.12 85.09,69.85 MOTOR3.2
N$47
  Top 0.305: 80.01,96.52 81.28,95.25 81.28,92.71 MOTOR4.2
  Top 0.406: B1.25 74.93,96.52 80.01,96.52
N$48
  Top 0.406: B1.23 76.2,95.25 77.47,95.25 79.03,92.91 78.94,87.61 79.02,87.53 79.02,85.19 78.9,85.07 78.74,76.2 78.74,53.34 MOTOR2.2
N$52  (via drill 0.35)
  Top 0.762: v93.98,95.25 93.98,81.28 v92.71,80.01 92.71,78.74 PUENTEH3.16 | v93.98,73.66 93.98,59.69 v92.71,58.42 92.71,57.15 PUENTEH2.16 | v93.98,52.07 93.98,38.1 v92.71,36.83 92.71,35.56 94.34,33.93 94.36,33.93 94.89,33.4 94.89,33.38 PUENTEH1.16 | v92.71,15.24 93.98,16.51 v93.98,30.48
  Top 1.27: IC1.1 17.5,24.41 17.5,24 18.41,23.09 20.87,23.09 22.37,21.59 C14.1
  Bottom 0.762: PUENTEH3.8 90.17,58.42 v92.71,58.42 | PUENTEH1.8 90.17,15.24 v92.71,15.24 | PUENTEH2.8 90.17,36.83 v92.71,36.83 | PUENTEH4.8 90.17,80.01 v92.71,80.01 | v93.98,95.25 95.25,96.52 PUENTEH4.16 | v93.98,73.66 95.25,74.93 PUENTEH3.16 | v93.98,52.07 95.25,53.34 PUENTEH2.16 | v93.98,30.48 95.25,31.75 PUENTEH1.16
  Bottom 1.27: IC3.3 IC2.3 | IC1.1 16.51,29.21 C11.1 | C14.1 62.79,21.59 72.95,11.43 72.95,10.08 74.85,8.18 83.11,8.18 PUENTEH1.8
  Bottom 1.524: IC4.3 IC2.3 21.59,20.32 C14.1
N$54
  Bottom 0.406: IC4.1 15.24,6.35
  Bottom 1.27: IC3.1 IC2.1
  Bottom 1.524: IC4.1 IC2.1 16.51,20.32 C13.1
  Bottom 2.54: X1.2 10.2,11.39 15.24,6.35 16.36,6.35

### Text on the board
tPlace: MAZE | Lions R.C. | + | -